# EAGLE design Automatic Night Light (EAGLE 9.6.2)
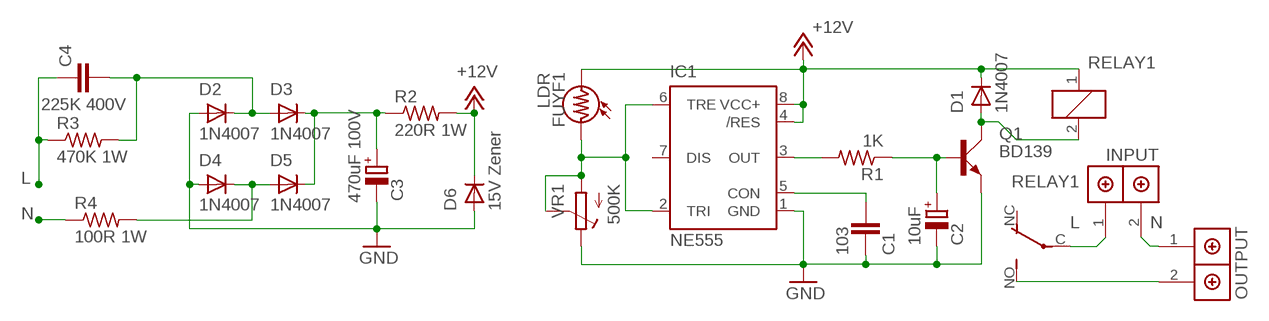
[diagram p0: schematic, sheet 1]

## Parts
C1  103  104  [104]
C2  10uF  10UF  [10UF/50V]
C3  470uF 100V  470UF/16V  [1000UF/16V]
C4  225K 400V  C-EU150-091X182  [C150-091X182]
D1  1N4007  1N4007204/7  [1N4007_V2]
D2  1N4007  1N4007204/7  [1N4007_V2]
D3  1N4007  1N4007204/7  [1N4007_V2]
D4  1N4007  1N4007204/7  [1N4007_V2]
D5  1N4007  1N4007204/7  [1N4007_V2]
D6  15V Zener  1N4007204/7  [1N4007_V2]
FUYF1  LDR  [LDR]
IC1  NE555  [DIL-08]
INPUT  INPUT  2P  [2P]
OUTPUT  2P  [2P]
Q1  BD139  [TO126AV]
R1  1K  RES204/7  [THR_R_204/7]
R2  220R 1W  1/2W  [1/2W]
R3  470K 1W  1/2W  [1/2W]
R4  100R 1W  1/2W  [1/2W]
RELAY1  RELAY  [RELAY]
VR1  500K  BLUE_VR  [BLUE_VR]

## Nets
+12V: D1.C D6.C FUYF1.3 IC1.4(/RES) IC1.8(VCC+) R2.2 RELAY1.1
GND: C1.2 C2.- C3.- D2.A D4.A D6.A IC1.1(GND) Q1.E VR1.1
L: C4.1 INPUT.1(CONN1) R3.1 RELAY1.C(2:C)
N: INPUT.2(CONN2) OUTPUT.1(CONN1) R4.1
N$1: C1.1 IC1.5(CON)
N$2: IC1.3(OUT) R1.2
N$3: FUYF1.1 IC1.2(TRI) IC1.6(TRE) VR1.2 VR1.3
N$4: C2.+ Q1.B R1.1
N$5: D1.A Q1.C RELAY1.2
N$6: C4.2 D2.C D3.A R3.2
N$7: OUTPUT.2(CONN2) RELAY1.NO(2:NO)
N$8: C3.+ D3.C D5.C R2.1
N$9: D4.C D5.A R4.2
Unconnected: IC1.7(DIS) RELAY1.NC(2:NC)

## Library data of the parts
C1 = MHN_Capacitor:104: Ciramic Capacitor - 104/103/22/33 pf
C2 = MHN_Capacitor:10UF: ELECTROLYTIC CAPACITOR grid 2.54 mm, diameter 5 mm
C3 = MHN_Capacitor:470UF/16V: ELECTROLYTIC CAPACITOR grid 5.08 mm, diameter 10.5 mm
C4 = rcl:C-EU: CAPACITOR, European symbol; SPICEPREFIX: C
D1-D6 = MHN_Diode:1N4007
FUYF1 = THR_LDR:LDR
IC1 = st-microelectronics:NE555: General purpose bipolar Timer; MF: Arrow Electronics; MPN: NE555N; OC_FARNELL: 1467742; OC_NEWARK: 89K1486
INPUT OUTPUT = MHN_TBlock:2P: Green Terminal Block
Q1 = transistor-power:BD139: NPN TRANSISTOR
R1 = MHN_Resistor:RES
R2-R4 = MHN_Resistor:1/2W
RELAY1 = MHN_Relay:RELAY: RELAY 1 x switch, 10 A/120 V AC, 8 A/30 V DC, Omron
VR1 = MHN_VR:BLUE_VR

## Board
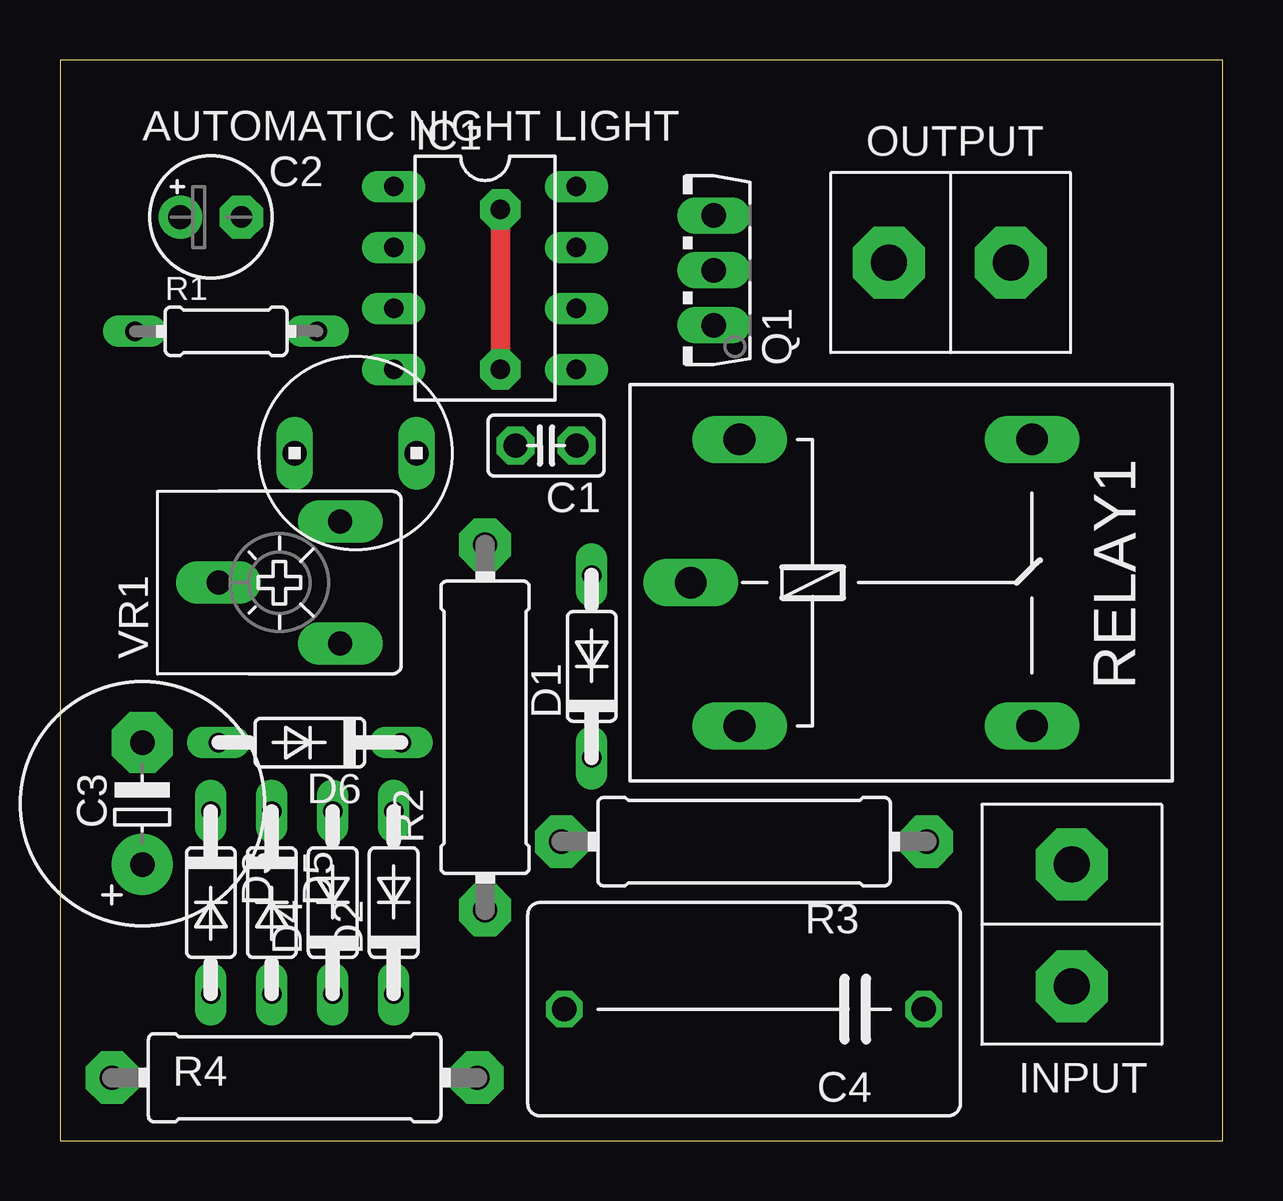
[diagram p1: board, top side]
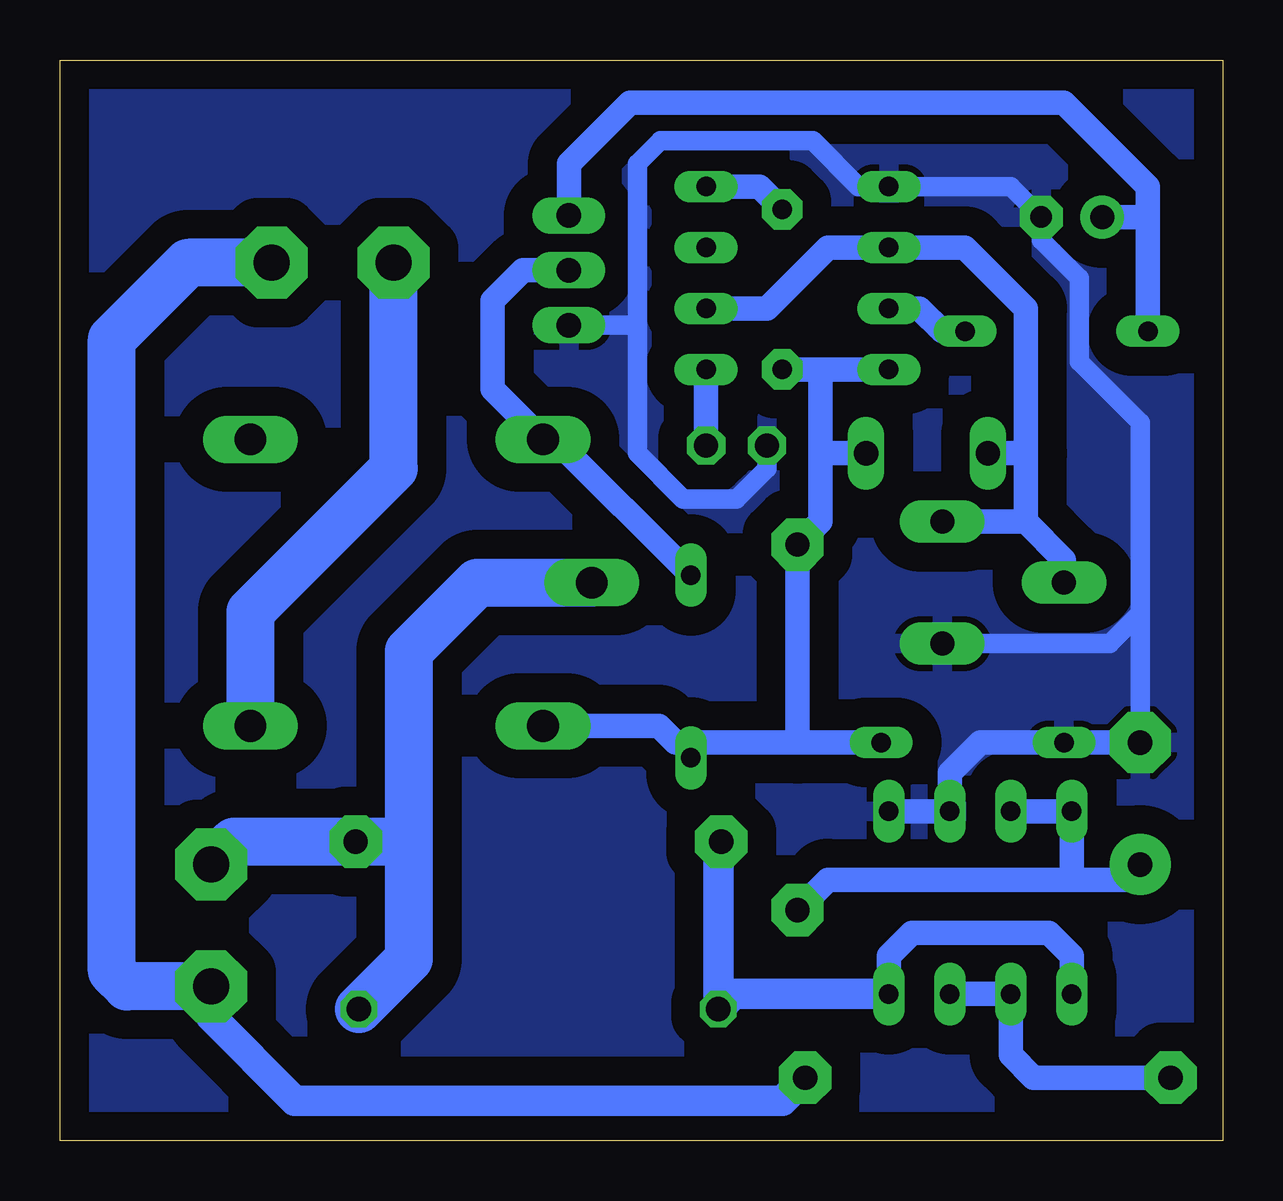
[diagram p2: board, bottom side, seen from below]

Size 48.46 x 45.05 mm. Coordinates in mm from the lower left corner, seen from the top.
Outline: 0,0 48.46,0 48.46,45.05 0,45.05 0,0
Copper layers (1*16): Top 0.035mm / dielectric 1.5mm / Bottom 0.035mm
Design rules "default": minimum track width 6mil, minimum drill 0.35mm, track to track 6mil, track to pad 6mil, pad to pad 6mil, via to via 6mil, smd to smd 6mil, copper to edge 40mil, drill to drill 6mil, minimum pad ring 10mil, minimum via ring 8mil, stop-mask expansion 4mil, vias tented up to drill 0mil, thermal gap 10mil

### Footprints (pad centres in the part's own frame; a part is rotated, then mirrored left to right if it is on the bottom)
104 = drill 1 pad 1.6 octagon: 1 -1.27,0; 2 1.27,0
10UF/50V = drill 1 pad 1.8: + -1.27,0 | drill 0.9 pad 1.8 octagon: - 1.27,0
1000UF/16V = drill 1.016 pad 2.54: + -2.54,0 | drill 1.016 pad 2.54 octagon: - 2.54,0
C150-091X182 = drill 1.016 octagon: 1 -7.493,0; 2 7.493,0
1N4007_V2 = drill 0.813 long: A 3.81,0; C -3.81,0
LDR = drill 1.016 long: 1 2.54,0; 3 -2.54,0
DIL-08 = drill 0.813 long: 1 -3.81,-3.81; 2 -1.27,-3.81; 3 1.27,-3.81; 4 3.81,-3.81; 5 3.81,3.81; 6 1.27,3.81; 7 -1.27,3.81; 8 -3.81,3.81
2P = drill 1.5 pad 3 octagon: 1 -2.54,0; 2 2.54,0
TO126AV = drill 1.016 long: B 2.286,-1.27; C 0,-1.27; E -2.286,-1.27
THR_R_204/7 = drill 0.813 long: 1 -3.81,0; 2 3.81,0
1/2W = drill 1.016 pad 2.184 octagon: 1 -7.62,0; 2 7.62,0
RELAY = drill 1.321 long: 1 -7.493,-5.969; 2 -7.493,5.969; C -9.525,0; NC 4.699,5.969; NO 4.699,-5.969
BLUE_VR = drill 1 pad 1.778 long: 1 -2.54,-2.54; 2 0,2.54; 3 2.54,-2.54

### Placement (x,y rotation side)
C1  20.26,28.98 180 top
C2  6.29,38.5 0 top
C3  3.43,14.05 90 top
C4  28.51,5.48 180 top
D1  22.17,19.77 90 top
D2  13.91,9.92 90 top
D3  6.29,9.92 270 top
D4  11.37,9.92 90 top
D5  8.83,9.92 270 top
D6  10.42,16.59 180 top
FUYF1  12.32,28.66 180 top
IC1  17.72,35.96 270 top
INPUT  42.17,8.97 270 top
OUTPUT  37.09,36.59 180 top
Q1  25.97,36.28 90 top
R1  6.93,33.74 0 top
R2  17.72,17.23 90 top
R3  28.51,12.46 180 top
R4  9.78,2.62 180 top
RELAY1  35.82,23.26 0 top
VR1  9.15,23.26 90 top

### Tracks (layer width: path | path; a pad name or v marks a point on that pad's centre or on a via)
+12V  (via drill 0.8 pad 1.7)
  Top 0.813: v18.36,38.82 v18.36,32.15
  Bottom 1.016: IC1.8 19.31,39.77 v18.36,38.82 | IC1.4 16.77,32.15 | 16.77,32.15 v18.36,32.15 | 16.77,28.66 16.77,25.8 R2.2 17.72,16.59 | 16.77,28.66 16.77,32.15 | FUYF1.3 16.77,28.66 | D6.C 17.72,16.59 | RELAY1.1 23.5,17.29 22.8,16.59 22.17,16.59 | 17.72,16.59 22.17,16.59 | D1.C 22.17,16.59
GND
  Bottom 0.813: C1.2 18.99,28.02 20.26,26.75 22.48,26.75 24.39,28.66 24.39,34.06 | 24.39,34.06 24.39,40.72 23.43,41.67 17.08,41.67 15.18,39.77 IC1.1 8.83,39.77 C2.- 7.56,37.55 5.97,35.96 5.97,32.47 3.43,29.93 3.43,21.99 | Q1.E 24.45,33.99 24.39,34.06 | VR1.1 4.7,20.72 3.43,21.99 | C3.- 3.43,21.99
  Bottom 1.016: D2.A D4.A 11.37,15.32 10.1,16.59 D6.A C3.-
  pour Bottom (isolate 1.2): 0.26,0.72 0.26,43.9 46.93,43.9 46.93,0.72
L
  Bottom 2: RELAY1.C 31.06,23.26 33.91,20.4 33.91,12.46 | C4.1 33.91,7.58 33.91,12.46 | 33.91,12.46 R3.1 41.22,12.46 INPUT.1
N
  Bottom 1.27: R4.1 18.36,1.67 38.67,1.67 42.17,5.16 INPUT.2
  Bottom 2: OUTPUT.1 43.12,36.59 46.29,33.42 46.29,7.07 45.66,6.43 INPUT.2
N$1
  Bottom 1.016: IC1.5 C1.1
N$2
  Bottom 1.016: IC1.3 12.64,34.69 11.69,33.74 R1.2
N$3
  Bottom 1.016: IC1.6 18.99,34.69 16.45,37.23 IC1.2 10.74,37.23 8.19,34.69 8.19,28.66 | VR1.2 6.61,24.21 8.19,25.8 | 8.19,25.8 8.19,28.66 | FUYF1.1 8.19,28.66 | VR1.3 8.19,25.8
N$4
  Bottom 0.813: R1.1 3.11,36.59 | 5.02,41.67 6.61,43.26
  Bottom 1.016: Q1.B 27.25,40.72 24.71,43.26 6.61,43.26 3.11,39.77 3.11,38.5 | R1.1 3.11,38.5 | C2.+ 3.11,38.5
N$5
  Bottom 1.016: D1.A 27.82,29.23 RELAY1.2 30.42,31.32 30.42,35.01 29.15,36.28 Q1.C
N$6
  Bottom 0.813: R3.2 21.02,12.34
  Bottom 1.016: D3.A 6.29,7.7 7.24,8.66 12.96,8.66 13.91,7.7 D2.C
  Bottom 1.27: 21.02,12.34 C4.2 20.39,6.12 D2.C
N$7
  Bottom 2: RELAY1.NO 40.52,22.05 34.55,28.02 OUTPUT.2
N$8
  Bottom 1.016: D5.C D3.C 6.29,10.88 | R2.1 16.45,10.88 6.29,10.88 | C3.+ 4.07,10.88 6.29,10.88
N$9
  Bottom 1.016: D4.C D5.A 8.83,3.57 7.88,2.62 R4.2

### Text on the board
tPlace: AUTOMATIC NIGHT LIGHT | OUTPUT | INPUT